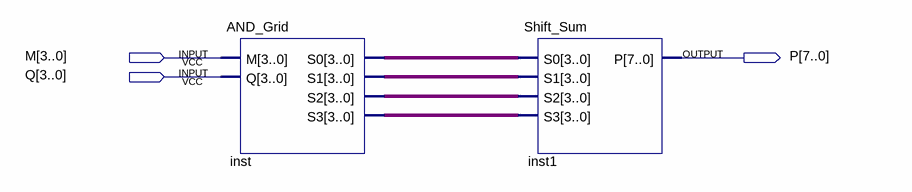
[diagram p0: schematic sheet]
// Quartus schematic 4bitMultiplier.bdf as structural Verilog: 2 symbols, 3 pins
module \4bitMultiplier  (
  input  [3:0] M,
  input  [3:0] Q,
  output [7:0] P
);

  wire [3:0] inst_s0, inst_s1, inst_s2, inst_s3;

  AND_Grid inst (.M(M), .Q(Q), .S0(inst_s0), .S1(inst_s1), .S2(inst_s2), .S3(inst_s3));
  Shift_Sum inst1 (.S0(inst_s0), .S1(inst_s1), .S2(inst_s2), .S3(inst_s3), .P(P));
endmodule
